# EAGLE design MCN Breakout (EAGLE 5.12)
PARTNO: 2-826629-0
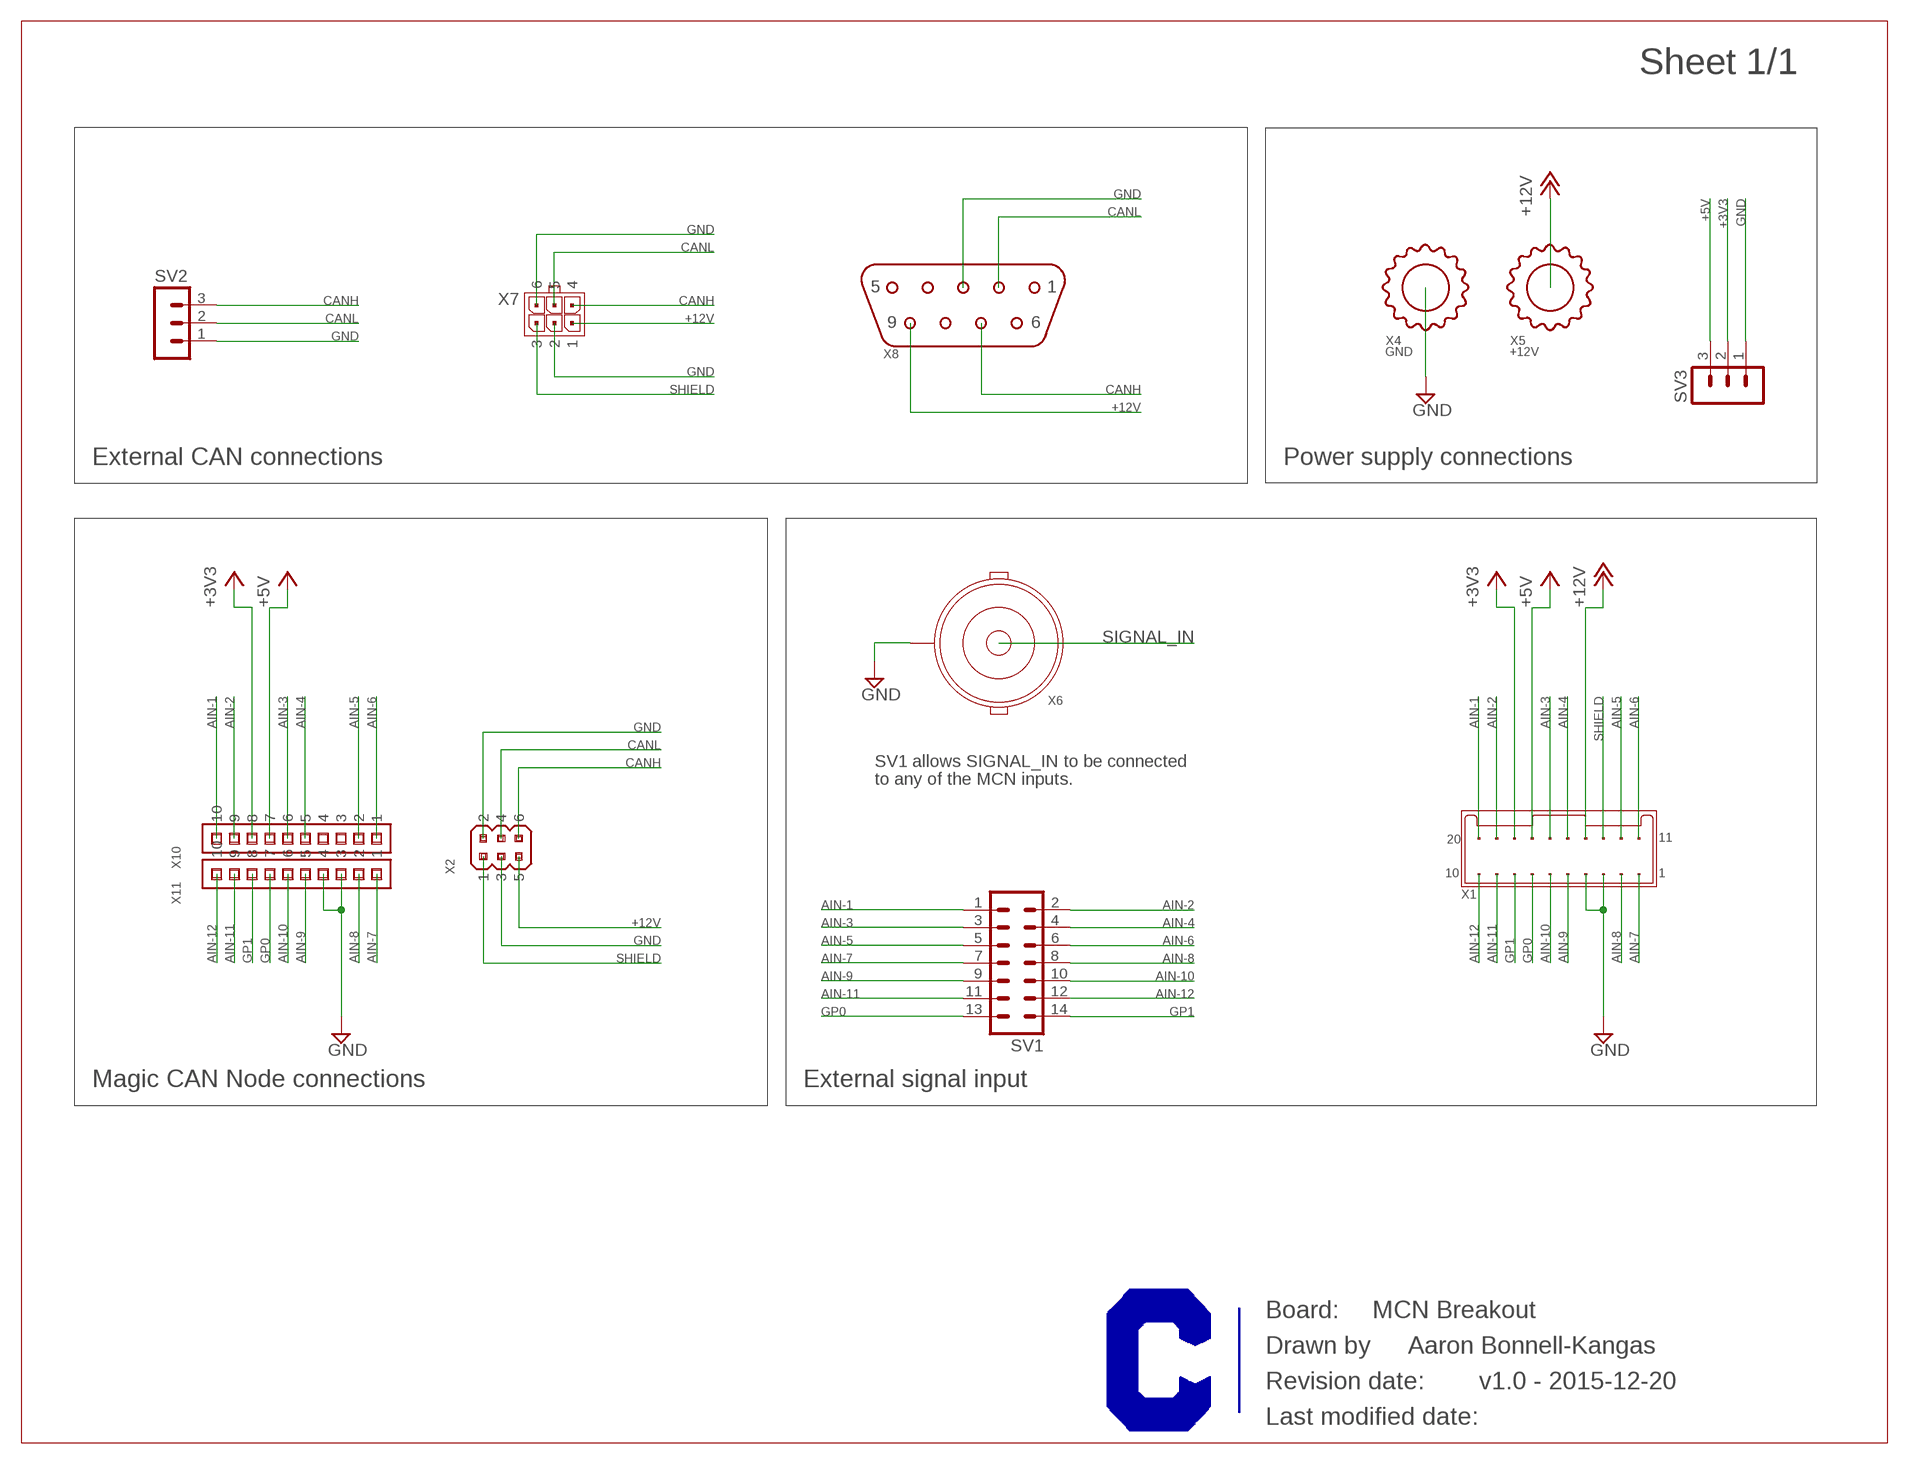
[diagram p0: schematic, sheet 1]

## Parts
SV1  MA07-2  [MA07-2]
SV2  MA03-1  [MA03-1]
SV3  MA03-1  [MA03-1]
X1  MICROCLASP-20-DUAL-RA  [MICROCLASP-20-DUAL-RA]
X2  M22-25203XX  [M22-25203XX]
X4  GND  BINDING_POST-BLACK-6-32  [BINDING_POST_6-32]
X5  +12V  BINDING_POST-RED-6-32  [BINDING_POST_6-32]
X6  BNC_JACK-RA  [BNC_RA_PCB]
X7  MICROFIT-06-DUAL-RA-SMD  [MICROFIT-6-DUAL-RA-SMD]
X8  DE-9_DB-9-RCPT-RA  [DE-9_RA]
X10  M22-71310XX  [M22-71310XX]
X11  M22-71310XX  [M22-71310XX]

## Nets
+3V3: SV3.2 X1.18 X10.8
+5V: SV3.3 X1.17 X10.7
+12V: X1.14 X2.5 X5.P$1 X7.1 X8.9
AIN-1: SV1.1 X1.20 X10.10
AIN-2: SV1.2 X1.19 X10.9
AIN-3: SV1.3 X1.16 X10.6
AIN-4: SV1.4 X1.15 X10.5
AIN-5: SV1.5 X1.12 X10.2
AIN-6: SV1.6 X1.11 X10.1
AIN-7: SV1.7 X1.1 X11.1
AIN-8: SV1.8 X1.2 X11.2
AIN-9: SV1.9 X1.5 X11.5
AIN-10: SV1.10 X1.6 X11.6
AIN-11: SV1.11 X1.9 X11.9
AIN-12: SV1.12 X1.10 X11.10
CANH: SV2.3 X2.6 X7.4 X8.7
CANL: SV2.2 X2.4 X7.5 X8.2
GND: SV2.1 SV3.1 X1.3 X1.4 X2.2 X2.3 X4.P$1 X6.SHELL@1(SHELL) X7.2 X7.6 X8.3 X11.3 X11.4
GP0: SV1.13 X1.7 X11.7
GP1: SV1.14 X1.8 X11.8
SHIELD: X1.13 X2.1 X7.3
SIGNAL_IN: X6.CENTER
Unconnected: X8.1 X8.4 X8.5 X8.6 X8.8 X10.3 X10.4

## Notes on the sheet
- External CAN connections | Power supply connections
- SV1 allows SIGNAL_IN to be connected
- to any of the MCN inputs.
- Magic CAN Node connections | External signal input
- MCN Breakout
- Aaron Bonnell-Kangas
- v1.0 - 2015-12-20

## Library data of the parts
SV1 = con-lstb:MA07-2: PIN HEADER; OC_FARNELL: unknown; OC_NEWARK: unknown
SV2 SV3 = con-lstb:MA03-1: PIN HEADER; OC_FARNELL: unknown; OC_NEWARK: unknown
X1 = Molex:MICROCLASP-20-DUAL
X2 = Harwin:M22-25203XX: M22-25203xx - 2.0mm pitch, 3x2 position male pin header Datasheet: https://cdn.harwin.com/pdfs/M22-252.pdf; PARTNO: M22-2520305
X4 = Generic connectors:BINDING_POST: Binding post This is a common type of connector that accepts bare wires, crimp-on connectors, and banana plugs. If you are placing these side-by-side, you should try to put them on 0.75" centers, which is the standard width of dual banana plug connectors.; PARTNO: 111-0703-001
X5 = Generic connectors:BINDING_POST: Binding post This is a common type of connector that accepts bare wires, crimp-on connectors, and banana plugs. If you are placing these side-by-side, you should try to put them on 0.75" centers, which is the standard width of dual banana plug connectors.; PARTNO: 111-0702-001
X6 = Molex:BNC_JACK: BNC jack, PCB mount, 50 ohm This is a PCB-mount BNC jack. Datasheet (right-angle variant): http://www.molex.com/pdm_docs/sd/731000154_sd.pdf; PARTNO: 73171-4230
X7 = Molex:MICROFIT-06-DUAL: Molex MicroFit 3.00mm Pitch Header, Surface Mount, Dual Row, 6 Circuits Note, November 2014: These come in three styles: Through-hole, with metal clip retention to PCB (not currently represented) (cheapest) SMD, with solder tab retention (-SMD) (more expensive, commonly stocked) SMD, with metal clip retention (-SMD-CLIP_RETENTION) (most expensive, not often stocked) Please use them in that order! Drawing: http://www.molex.com/pdm_docs/sd/430450609_sd.pdf (right-angle) Information: http://www.molex.com/molex/products/datasheet.jsp?part=active/0430450618_PCB_HEADERS.xml; PARTNO: 43045-0609
X8 = Generic footprints:DE-9_DB-9: DE-9 (aka DB-9) PCB header The actual descriptor for this connector is DE-9 (shell size DE, 9 positions), but it is commonly referred to as DB-9.; PARTNO: 1734354-1
X10 X11 = Harwin:M22-71310XX: Harwin M22-71310XX - 10pos single row female pin hdr, 2mm pitch Datasheet: https://cdn.harwin.com/pdfs/M22-713.pdf; PARTNO: M22-7131042

## Board
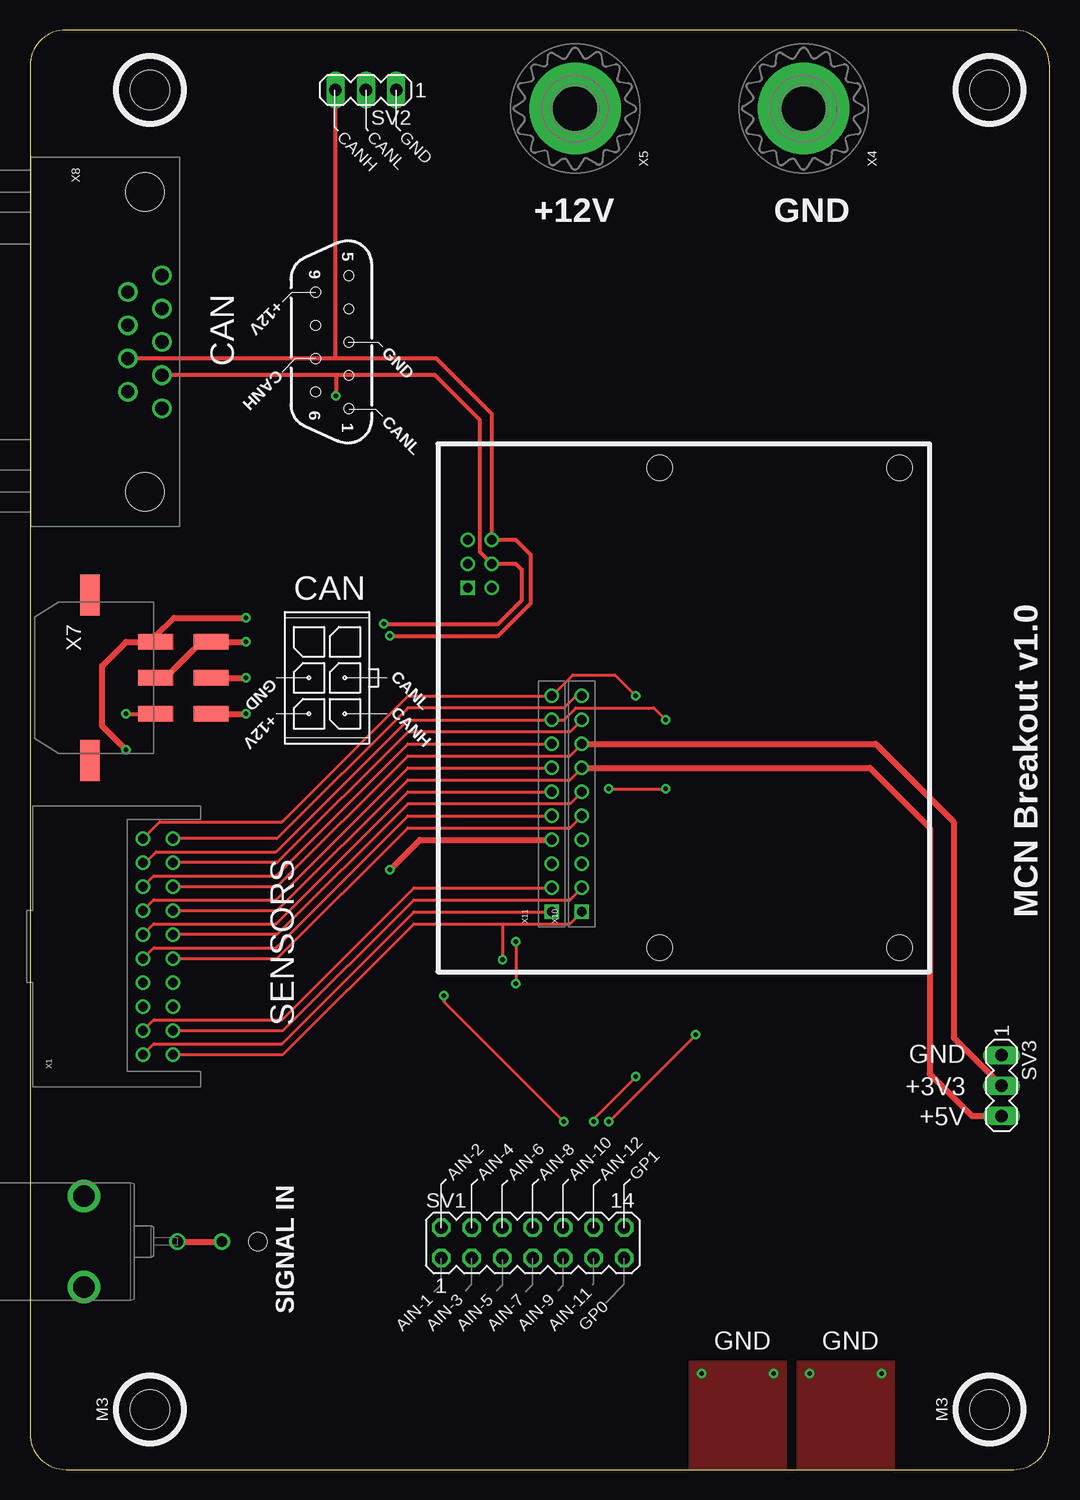
[diagram p1: board, top side]
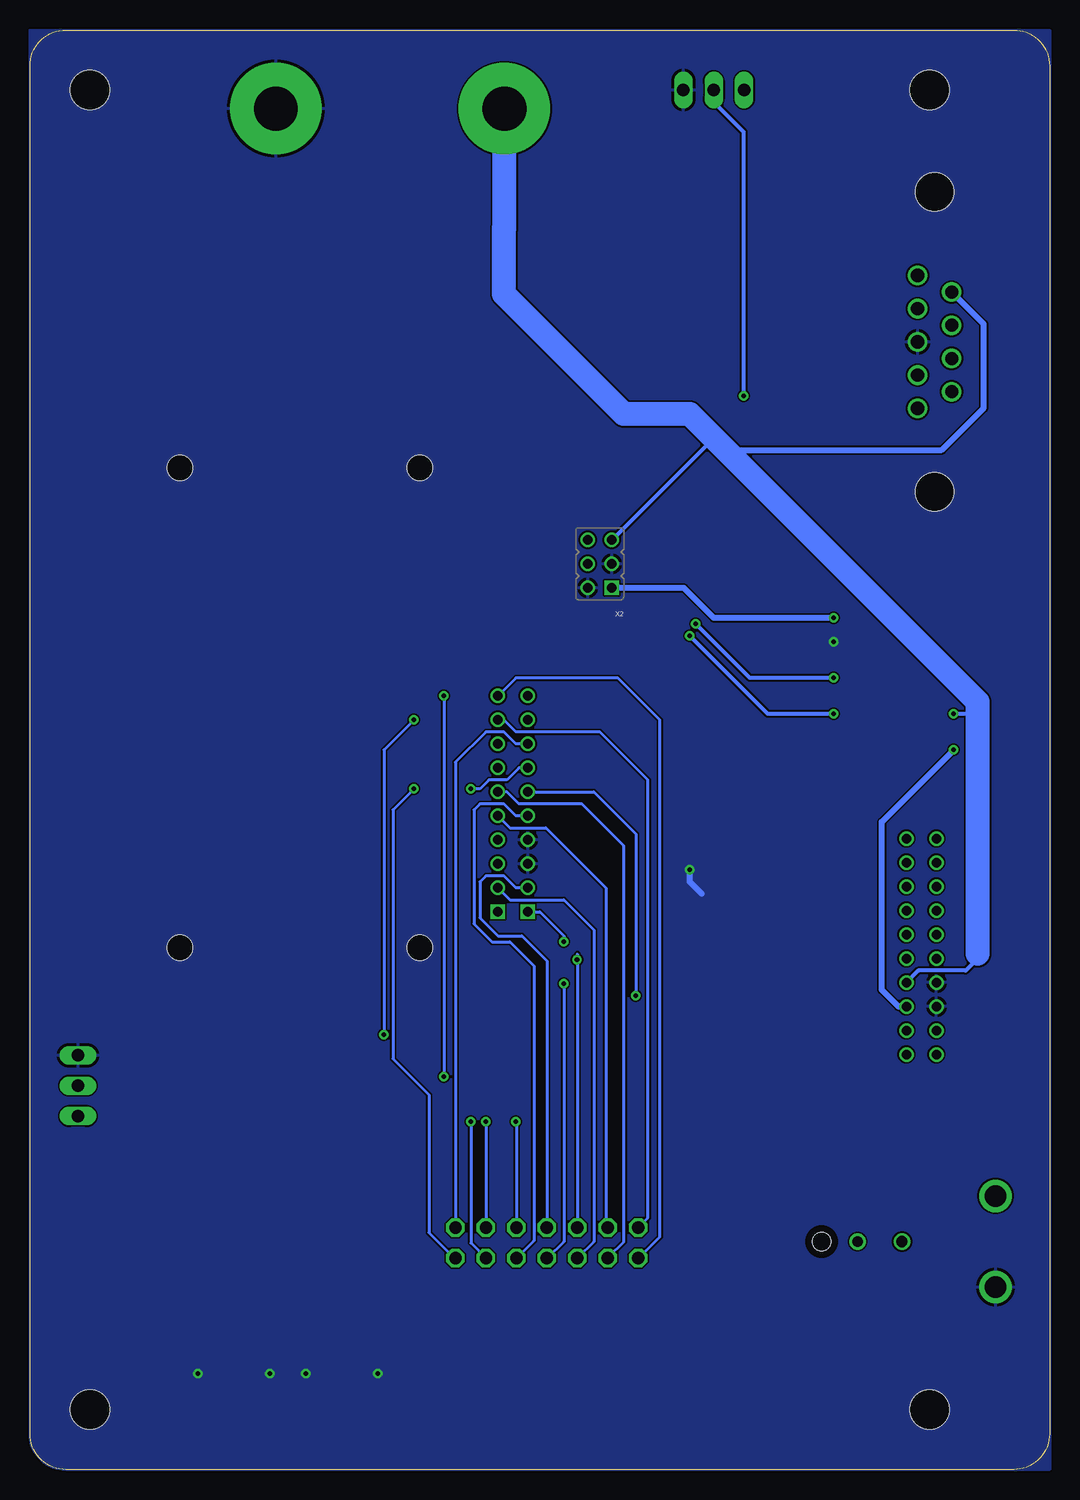
[diagram p2: board, bottom side, seen from below]

Size 85 x 120 mm. Coordinates in mm from the lower left corner, seen from the top.
Outline: 82,0 arc90 85,3 85,117 arc90 82,120 3,120 arc90 0,117 0,3 arc90 3,0 82,0
Copper layers (1*16): Top 0.0356mm / dielectric 1.5011mm / Bottom 0.0356mm
Design rules "OSH Park 2-layer *": minimum track width 6mil, minimum drill 13mil, track to track 6mil, track to pad 6mil, pad to pad 6mil, via to via 6mil, smd to smd 6mil, copper to edge 0mil, drill to drill 6mil, minimum pad ring 7mil, minimum via ring 7mil, stop-mask expansion 4mil, vias tented up to drill 25mil, thermal gap 10mil
Holes 2.1 mm at 52.5,43.5 72.5,43.5 72.5,83.5 52.5,83.5
Holes 3.3 mm at 10,5 80,115 10,115 80,5
Holes 1.5 mm at 19,19
bRestrict: area 17.9,17.9 to 20.1,20.1

### Footprints (pad centres in the part's own frame; a part is rotated, then mirrored left to right if it is on the bottom)
MA07-2 = drill 1.016 octagon: 1 -7.62,-1.27; 2 -7.62,1.27; 3 -5.08,-1.27; 4 -5.08,1.27; 5 -2.54,-1.27; 6 -2.54,1.27; 7 0,-1.27; 8 0,1.27; 9 2.54,-1.27; 10 2.54,1.27; 11 5.08,-1.27; 12 5.08,1.27; 13 7.62,-1.27; 14 7.62,1.27
MA03-1 = drill 1.016 long: 1 -2.54,0; 2 0,0; 3 2.54,0
MICROCLASP-20-DUAL-RA = drill 0.8 round: 1 -9,0; 2 -7,0; 3 -5,0; 4 -3,0; 5 -1,0; 6 1,0; 7 3,0; 8 5,0; 9 7,0; 10 9,0; 11 -9,-2.5; 12 -7,-2.5; 13 -5,-2.5; 14 -3,-2.5; 15 -1,-2.5; 16 1,-2.5; 17 3,-2.5; 18 5,-2.5; 19 7,-2.5; 20 9,-2.5
M22-25203XX = drill 0.8 square: 1 -1,2 | drill 0.8 round: 2 1,2; 3 -1,0; 4 1,0; 5 -1,-2; 6 1,-2
BINDING_POST_6-32 = drill 3.658 pad 7.62 round: P$1 0,0
BNC_RA_PCB = drill 0.92 round: CENTER 0,-7.8 | drill 1.8 round: SHELL@1 -3.8,0; SHELL@2 3.8,0
MICROFIT-6-DUAL-RA-SMD = smd 1.27 x 2.921: 1 3,5.47; 2 0,5.47; 3 -3,5.47; 4 3,10.1; 5 0,10.1; 6 -3,10.1 | smd 3.429 x 1.651: P$9 6.883,0; P$10 -6.883,0
DE-9_RA = drill 1.09 round: 1 5.54,0; 2 2.77,0; 3 0,0; 4 -2.77,0; 5 -5.54,0; 6 4.155,-2.84; 7 1.385,-2.84; 8 -1.385,-2.84; 9 -4.155,-2.84 | hole 3.18: -12.495,-1.42; 12.495,-1.42
M22-71310XX = drill 0.8 square: 1 0,-9 | drill 0.8 round: 2 0,-7; 3 0,-5; 4 0,-3; 5 0,-1; 6 0,1; 7 0,3; 8 0,5; 9 0,7; 10 0,9

### Placement (x,y rotation side)
SV1  41.91,18.89 0 top
SV2  28,115 180 top
SV3  81,32 270 top
X1  9.42,43.6 90 top
X2  37.5,75.5 180 bottom
X4  64.5,113.45 90 top
X5  45.45,113.45 90 top
X6  4.5,19 90 top
X7  5,66 270 top
X8  11,94 270 top
X10  46,55.5 0 top
X11  43.5,55.5 0 top

### Tracks (layer width: path | path; a pad name or v marks a point on that pad's centre or on a via)
+3V3
  Top 0.25: X1.18 20.6,48.6 31.5,59.5 45,59.5 X10.8
  Top 0.5: X10.8 70.5,60.5 77,54 77,36 SV3.2
+5V
  Top 0.25: X10.7 45,57.5 31.5,57.5 20.6,46.6 X1.17
  Top 0.5: X10.7 70,58.5 75,53.5 75,33 78.54,29.46 SV3.3 81.04,29.5
+12V  (via drill 0.4)
  Top 0.35: v8,63 X7.1
  Bottom 0.35: X1.14 10.92,41.6 7,41.6 6,42.6 6,43 | 28,86 X2.5 | 6,63 v8,63
  Bottom 0.5: 44.84,98.16 45,98 45,97.5 | X8.9 5.5,95.5 5.5,88.5 9,85 27,85 28,86
  Bottom 2: X5.P$1 45.45,103.45 45.5,103.5 45.5,98 45,97.5 35.5,88 30,88 28,86 6,64 6,63 6,43
AIN-1
  Top 0.25: X1.20 20.6,52.6 31.5,63.5 44.5,63.5 45.5,64.5 X10.10
  Bottom 0.25: SV1.1 32.5,19.41 32.5,62.5 36,66 44.5,66 X10.10
AIN-2
  Top 0.25: X1.19 20.6,50.6 31.5,61.5 45,61.5 X10.9
  Bottom 0.25: SV1.2 34.29,20.21 33.5,21 33.5,57.5 37.5,61.5 44.5,61.5 45.5,62.5 X10.9
AIN-3
  Top 0.25: X1.16 20.6,44.6 31.5,55.5 45,55.5 X10.6
  Bottom 0.25: SV1.3 36.83,17.67 35.5,19 35.5,52 39,55.5 44.25,55.5 45.25,56.5 X10.6
AIN-4
  Top 0.25: X10.5 45,53.5 31.5,53.5 20.6,42.6 X1.15
  Bottom 0.25: SV1.4 36.83,20.33 37,20.5 37,48.5 42,53.5 45,53.5 X10.5
AIN-5
  Top 0.25: X10.2 45,47.5 32,47.5 21.1,36.6 X1.12
  Bottom 0.25: SV1.5 38,19 38,45 40.5,47.5 45,47.5 X10.2
AIN-6  (via drill 0.4)
  Top 0.25: X10.1 45,45.5 39.5,45.5 | 39.5,45.5 32,45.5 21.1,34.6 X1.11 | v39.4,42.5 39.4,45.4 39.5,45.5
  Bottom 0.25: SV1.6 39.37,42.97 v39.4,42.5
AIN-7  (via drill 0.4)
  Top 0.25: X11.1 32,46.5 21,35.5 10.32,35.5 X1.1 | v40.5,44 v40.5,40.5
  Bottom 0.25: SV1.7 41.88,17.62 40.5,19 v40.5,40.5 | v40.5,44 40.5,44.5 42.5,46.5 X11.1
AIN-8
  Top 0.25: X1.2 10.32,37.5 21,37.5 32,48.5 X11.2
  Bottom 0.25: SV1.8 41.91,42.41 44,44.5 46,44.5 47.5,46 47.5,49 47,49.5 45.5,49.5 44.5,48.5 X11.2
AIN-9
  Top 0.25: X11.5 31.5,54.5 20.5,43.5 10.32,43.5 X1.5
  Bottom 0.25: SV1.9 43,19.07 43,42 45,44 46.5,44 48,45.5 48,55 47.5,55.5 45.5,55.5 44.5,54.5 X11.5
AIN-10  (via drill 0.4)
  Top 0.25: X11.6 31.5,56.5 20.5,45.5 10.32,45.5 X1.6 | v44.5,29 34.5,39 v34.5,39.5
  Bottom 0.25: SV1.10 44.45,28.95 v44.5,29 | X11.6 38,56.5 34.5,53 v34.5,39.5
AIN-11  (via drill 0.4)
  Top 0.25: X1.9 9.5,50.52 9.5,50.5 10.5,51.5 20.5,51.5 31.5,62.5 X11.9 44.5,62.5 45.5,63.5 52,63.5 v53,62.5 | v55.5,36.25 v48.25,29
  Bottom 0.25: SV1.11 48.25,18.88 v48.25,29 | v55.5,36.25 55.5,60 v53,62.5
AIN-12  (via drill 0.4)
  Top 0.25: X1.10 10.82,54 21,54 31.5,64.5 X11.10 45.25,66.25 48.75,66.25 v50.5,64.5 | v47,29 47,29.25 v50.5,32.75
  Bottom 0.25: SV1.12 v46.99,28.99 v47,29 | v50.5,64.5 v50.5,32.75
CANH  (via drill 0.4)
  Top 0.35: v30,69.5 39,69.5 41.75,72.25 41.75,76.25 40.5,77.5 X2.6 38.5,88 33.88,92.61 25.5,92.61 | 25.5,92.61 X8.7 | SV2.3 25.46,92.66 25.5,92.61
  Top 0.5: X7.4 v18,63
  Bottom 0.35: v30,69.5 23.5,63 v18,63
CANL  (via drill 0.4)
  Top 0.35: v29.5,70.5 39,70.5 41,72.5 41,75 40.5,75.5 X2.4 37.5,76.5 37.5,87.5 33.77,91.23 25.5,91.23 | 25.5,91.23 X8.2 | 25.5,91.23 v25.5,89.5
  Top 0.5: X7.5 v18,66
  Bottom 0.35: v29.5,70.5 25,66 v18,66 | SV2.2 28,114 25.5,111.5 v25.5,89.5
GND  (via drill 0.4)
  Top 0.5: v18,69 X7.6 14.25,69 11.5,66.25 10.72,66.25 X7.2 | X11.4 32.5,52.5 v30,50
  Bottom 0.5: v30,50 30,49 29,48
  other vias: 56,8 62,8 65,8 71,8
  pour Top: 55,0 55,9 63,9 63,0
  pour Bottom (rank 2): 0,120 0,0 82,0 arc90 85,3 85,120
  pour Bottom: 64,9 64,0 72,0 72,9
  pour Bottom: 55,9 55,0 63,0 63,9
  pour Top: 64,9 64,0 72,0 72,9
GP0  (via drill 0.4)
  Top 0.25: X11.7 31.5,58.5 20.5,47.5 10.32,47.5 X1.7 | v48.25,56.75 v53,56.75
  Bottom 0.25: SV1.13 49.62,17.62 51.75,19.75 51.75,31.25 54.75,34.25 54.75,55 v53,56.75 | v48.25,56.75 47.5,56.75 46.75,57.5 45.25,57.5 44.25,58.5 X11.7
GP1
  Top 0.25: X11.8 31.5,60.5 20.5,49.5 10.32,49.5 X1.8
  Bottom 0.25: SV1.14 49.53,58.97 47,61.5 45.5,61.5 44.5,60.5 X11.8
SHIELD  (via drill 0.4)
  Top 0.5: v8,60 6,62 6,67 8,69 X7.3 10.47,69.47 12,71 v18,71
  Bottom 0.5: X1.13 12.6,38.6 14,40 14,54 v8,60 | v18,71 28,71 30.5,73.5 X2.1
SIGNAL_IN  (via drill 0.89)
  Top 0.5: X6.CENTER v16,19

### Text on the board
tPlace: CANH | CANL | GND | +12V | GND | 5 | 9 | +12V | GND | CAN | CANH | 6 | 1 | CANL | CAN | GND | CANL | +12V | CANH | MCN Breakout v1.0 | SENSORS | GND | +3V3 | +5V | AIN-2 | AIN-4 | AIN-6 | AIN-8 | AIN-10 | AIN-12 | GP1 | SIGNAL IN | AIN-1 | AIN-3 | AIN-5 | AIN-7 | AIN-9 | AIN-11 | GP0 | GND | GND | M3 | M3